# EAGLE design Tritag_Color_Sensor_Board_1.1 (EAGLE 9.5.0)
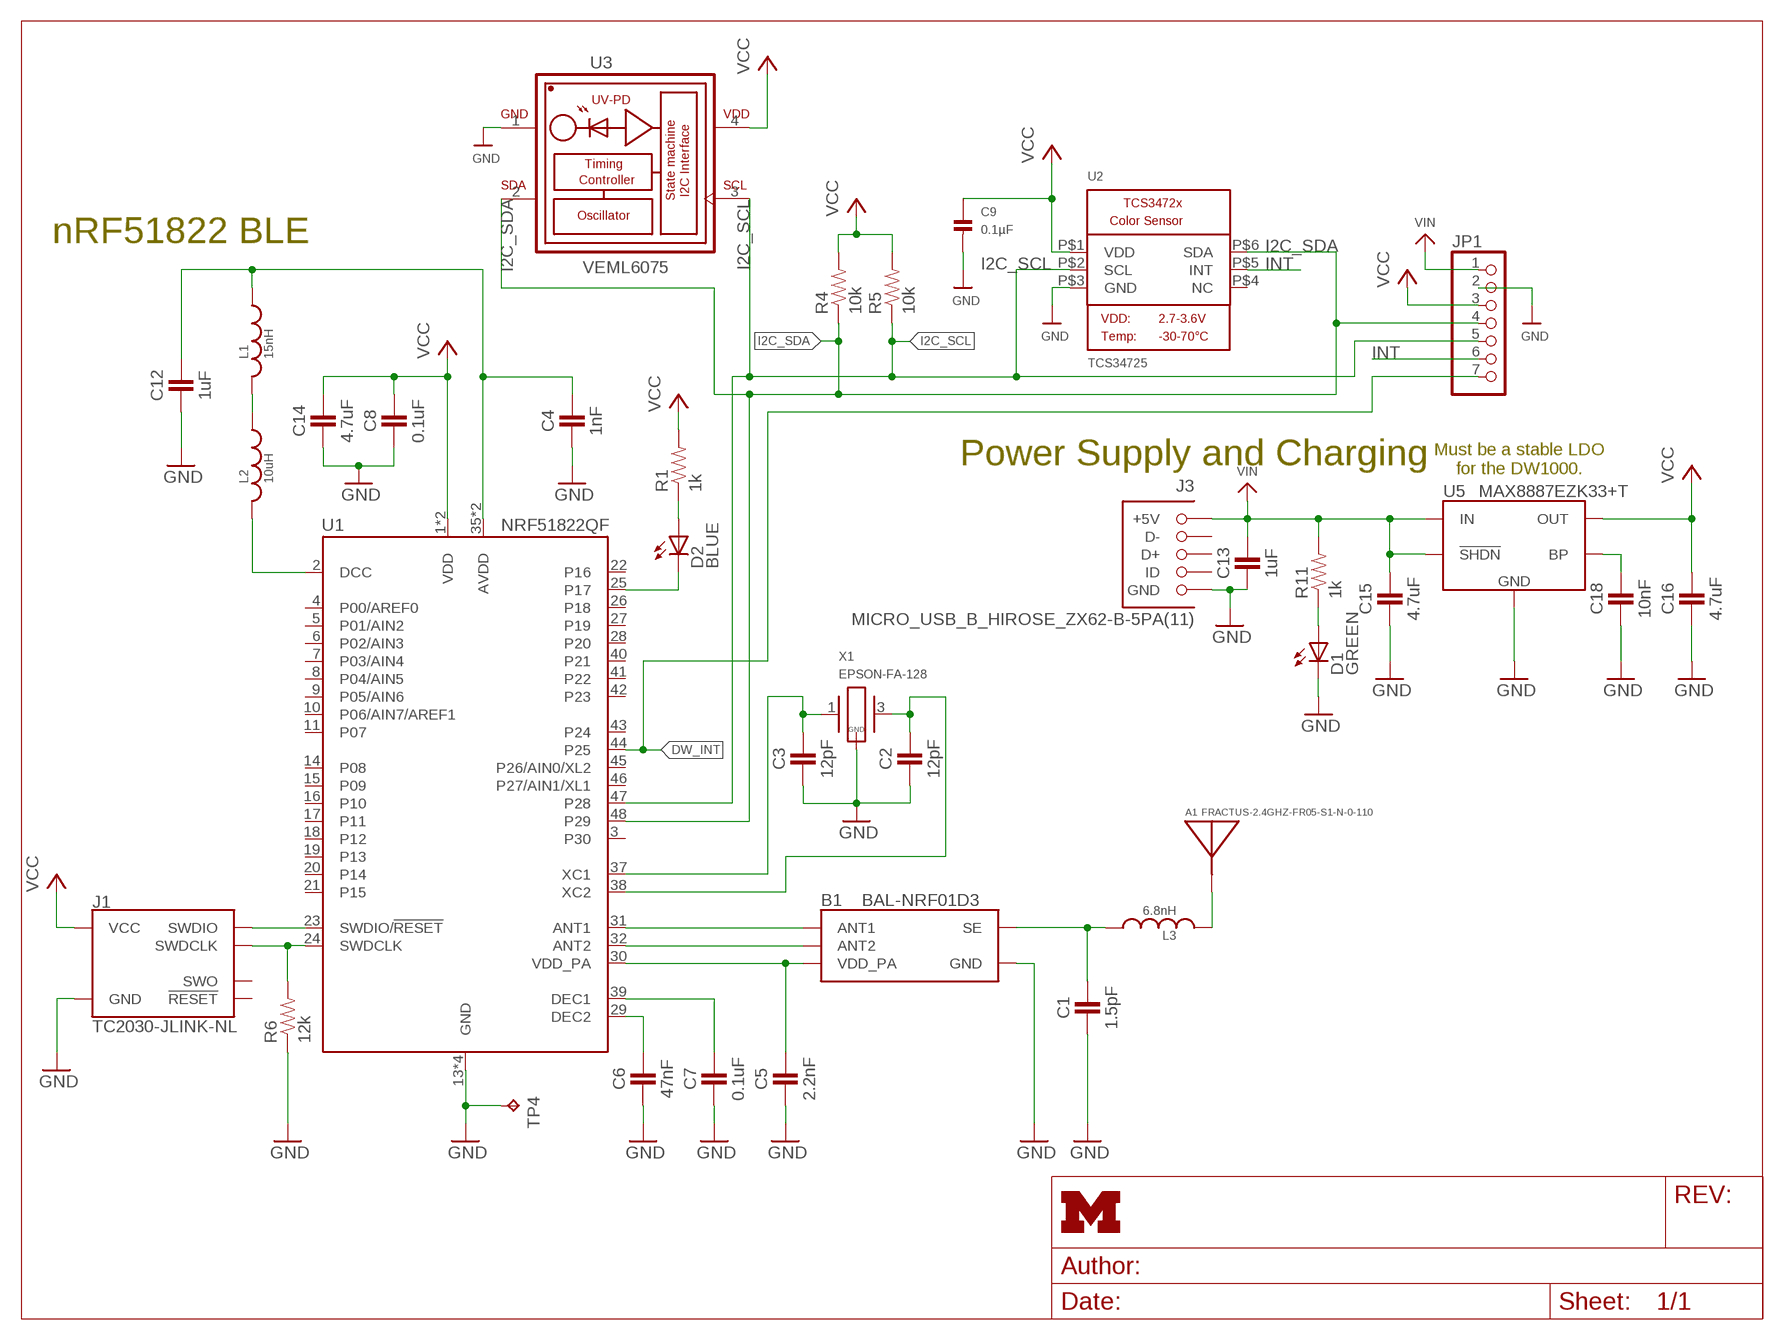
[diagram p0: schematic, sheet 1]
FRAME2 (LETTER_L): HEIGHT: 8.5in; WIDTH: 11in

## Parts
A1  FRACTUS-2.4GHZ-FR05-S1-N-0-110  [FRACTUS-ANTENNA-FR05-S1-N-0-110]
B1  BAL-NRF01D3  [BAL-NRF01D3]
C1  1.5pF  CAPACITOR  [0402_CAP]
C2  12pF  CAPACITOR  [0402_CAP]
C3  12pF  CAPACITOR  [0402_CAP]
C4  1nF  CAPACITOR  [0402_CAP]
C5  2.2nF  CAPACITOR  [0402_CAP]
C6  47nF  CAPACITOR  [0402_CAP]
C7  0.1uF  CAPACITOR  [0402_CAP]
C8  0.1uF  CAPACITOR  [0402_CAP]
C9  0.1µF  CAP_CERAMIC_0805  [_0805]
C12  1uF  CAPACITOR  [0402_CAP]
C13  1uF  CAPACITOR  [0402_CAP]
C14  4.7uF  CAPACITOR  [0402_CAP]
C15  4.7uF  CAPACITOR  [0402_CAP]
C16  4.7uF  CAPACITOR  [0402_CAP]
C18  10nF  CAPACITOR  [0402_CAP]
D1  GREEN  LED0603  [LED-0603]
D2  BLUE  LED0603  [LED-0603]
J1  TC2030-JLINK-NL  [TC2030-IDC-NL]
J3  MICRO_USB_B_HIROSE_ZX62-B-5PA(11)  [USB_MICRO_B-HIROSE-ZX62-B-5PA(11)]
JP1  HEADER-1X770MIL  [1X07_ROUND_70]
L1  15nH  INDUCTOR0402  [0402_CAP]
L2  10uH  INDUCTOR0603  [0603_CAP]
L3  6.8nH  INDUCTOR0402  [0402_CAP]
R1  1k  RESISTOR0402_RES  [0402_RES]
R4  10k  RESISTOR0402_RES  [0402_RES]
R5  10k  RESISTOR0402_RES  [0402_RES]
R6  12k  RESISTOR0402_RES  [0402_RES]
R11  1k  RESISTOR0402_RES  [0402_RES]
TP4  TPTP06SQ  [TP06SQ]
U1  NRF51822QF  [QFN-48-6MM]
U2  TCS34725  LIGHT_TCS3472  [TCS3472_FN6]
U3  VEML6075  [VISHAY_VEML6075_1.25X2X1]
U5  MAX8887EZK33+T  [SOT-23-5]
X1  EPSON-FA-128  [FA-128]

## Nets
!CHRG: D1.A R11.1
!CHRG1: D2.A R1.1
ANTENNA: A1.ANT(ANTENNA) L3.2
AVDD: C4.1 C12.1 L1.1 U1.35(AVDD) U1.36(AVDD)
DCC: L2.2 U1.2(DCC)
DW_INT: JP1.7 U1.44(P25)
GND: B1.GND C1.2 C2.2 C3.2 C4.2 C5.2 C6.2 C7.2 C8.2 C9.2 C12.2 C13.2 C14.2 C15.2 C16.2 C18.2 D1.C J1.5(GND) J3.5(GND) JP1.2 R6.1 TP4.TP U1.13(GND) U1.33(GND) U1.34(GND) U1.GND U2.P$3(GND) U3.1(GND) U5.2(GND) X1.2(GND) X1.4(GND)
I2C_SCL: JP1.5 R5.1 U1.47(P28) U2.P$2(SCL) U3.3(SCL)
I2C_SDA: JP1.4 R4.1 U1.48(P29) U2.P$6(SDA) U3.2(SDA)
INT: JP1.6 U2.P$5(INT)
N$2: B1.SE C1.1 L3.1
N$6: D2.C U1.25(P17)
N$9: C3.1 U1.37(XC1) X1.1
N$10: C2.1 U1.38(XC2) X1.3
N$11: C18.1 U5.4(BP)
N$15: C6.1 U1.29(DEC2)
N$17: C7.1 U1.39(DEC1)
N$18: B1.ANT1 U1.31(ANT1)
N$19: B1.ANT2 U1.32(ANT2)
N$20: B1.VCC(VDD_PA) C5.1 U1.30(VDD_PA)
N$37: L1.2 L2.1
SWDCLK: J1.4(SWDCLK) R6.2 U1.24(SWDCLK)
SWDIO/!RESET: J1.2(SWDIO) U1.23(SWDIO/!RESET)
VCC: C8.1 C9.1 C14.1 C16.1 J1.1(VCC) JP1.3 R1.2 R4.2 R5.2 U1.1(VDD) U1.12(VDD) U2.P$1(VDD) U3.4(VDD) U5.5(OUT)
VIN: C13.1 C15.1 J3.1(+5V) JP1.1 R11.2 U5.1(IN) U5.3(!SHDN)
Unconnected: J1.3(!RESET) J1.6(SWO) J3.2(D-) J3.3(D+) J3.4(ID) U1.3(P30) U1.4(P00/AREF0) U1.5(P01/AIN2) U1.6(P02/AIN3) U1.7(P03/AIN4) U1.8(P04/AIN5) U1.9(P05/AIN6) U1.10(P06/AIN7/AREF1) U1.11(P07) U1.14(P08) U1.15(P09) U1.16(P10) U1.17(P11) U1.18(P12) U1.19(P13) U1.20(P14) U1.21(P15) U1.22(P16) U1.26(P18) U1.27(P19) U1.28(P20) U1.40(P21) U1.41(P22) U1.42(P23) U1.43(P24) U1.45(P26/AIN0/XL2) U1.46(P27/AIN1/XL1) U2.P$4(NC)

## Notes on the sheet
- nRF51822 BLE
- Power Supply and Charging
- Must be a stable LDO
  for the DW1000.

## Library data of the parts
A1 = chips:FRACTUS-2.4GHZ-FR05-S1-N-0-110: Fractus Micro Reach Xtend Requires matching network.; RICHARDSON_RFPD: FR05-S1-N-0110B
B1 = chips:BAL-NRF01D3: 50 ohm nominal input / conjugate match balun to nRF51422-QFAA, nRF24LE1, nRF51822-QFAA/AB, with integrated harmonic filter; DIGIKEY: 497-13637-1-ND; MOUSER: 511-BAL-NRF01D3
C1-C8 C12-C16 C18 = passives:CAPACITOR: 0402 Capacitor
C9 = microbuilder:CAP_CERAMIC: Ceramic Capacitors 0402 - 0402 Surface Mount Capacitors 16pF 50V 5% [Digikey: 445-4899-2-ND] 18pF 50V 5% [Digikey: 490-1281-2-ND] 22pF 50V 5% [Digikey: 490-1283-2-ND] 68pF 50V 5% [Digikey: 490-1289-2-ND] 0.1uF 10V 10% [Digikey: 490-1318-2-ND] 1.0uF 6.3V 10% [Digikey: 490-1320-2-ND] 0603 - 0603 Surface Mount Capacitors 16 pF 50V 5% [Digikey: 445-5051-2-ND] 22 pF 50V [Digikey: PCC220ACVTR-ND] 33 pF 50V 5% [Digikey: 490-1415-1-ND] 56pF 50V 5% [Digikey: 490-1421-1-ND] 220pF 50V 5% [Digikey: 445-1285-1-ND] 680 pF 50V 2200 pF 50V 5% C0G [Digikey: 445-1297-1-ND] 5600 pF 100V 5% X7R [Digikey: 478-3711-1-ND] 0.1 µF 25V 10% [Digikey: PCC2277TR-ND] 0.22 µF 16V 10% X7R [Digikey: 445-1318-1-ND] 1.0 µF 25V 10% [Digikey: 445-5146-2-ND] 0603 - RF Specific 3pF 250V +/-0.1pF RF [Digikey: 712-1347-1-ND] 18 pF 250V 5% [Digikey: 478-3505-1-ND or 712-1322-1-ND] 56 pF 250V 5% C0G RF [Digikey: 490-4867-1-ND] 68 pF 250V RF [Digikey: 490-4868-1-ND] 0805 - 0805 Surface Mount Capacitors 220 pF 250V 2% RF Ceramic Capacitor [Digikey: 712-1398-1-ND] 1000 pF 50V 2% NP0 Ceramic Capacitor [Digikey: 478-3760-1-ND] 0.1 µF 25V 10% Ceramic Capacitor [Digikey: PCC1828TR-ND] 1.0 µF 16V 10% Ceramic Capacitor[Digikey: 490-1691-2-ND] 10.0 µF 10V 10% Ceramic Capacitor[Digikey: 709-1228-1-ND] 10.0 uF 16V 10% Ceramic Capacitor [Digikey: 478-5165-2-ND] 47 uF 6.3V 20% Ceramic Capacitor [Digikey: 587-1779-1-ND or 399-5506-1-ND] 1206 - 1206 Surface Mount Capacitors 47uF 10V 20% Ceramic Capacitor [Digikey: 490-5528-1-ND or 399-5508-1-ND or 445-6010-1-ND] 100uF 6.3V -20%, +80% Y5V Ceramic Capacitor (Digikey: 490-4512-1-ND, Mouser: 81-GRM31CF50J107ZE1L)
D1 D2 = SparkFun-LED:LED: LEDs Standard schematic elements and footprints for 5mm, 3mm, 1206, and 0603 sized LEDs. 5mm - Spark Fun Electronics SKU : COM-00529 (and others)
J1 = connector:TC2030-JLINK
J3 = connector:MICRO_USB_B_HIROSE_ZX62-B-5PA(11): Connector Receptacle USB - micro B 2.0 5 Position Surface Mount, Right Angle, Horizontal Bottom Mount; DIGIKEY: H11634CT-ND; MOUSER: 798-ZX62-B-5PA11; NEWARK: 86P8793
JP1 = microbuilder:HEADER-1X7: PIN HEADER
L1-L3 = passives:INDUCTOR
R1 R4-R6 R11 = passives:RESISTOR: Resistor Basic schematic elements and footprints for 0603, 1206, and PTH resistors.
TP4 = testpad:TP: Test pad
U1 = chips:NRF51822: Multiprotocol Bluetooth® 4.0 low energy/2.4 GHz RF SoC; DIGIKEY: 1490-1032-1-ND; MOUSER: 949-NRF51822-QFAB-R7
U2 = microbuilder:LIGHT_TCS3472: TCS3472 RGB + Clear Color Sensor VDD: 2.7-3.6V Temp: -30 - 70°C IR light blocking filter 3,800,000:1 Dynamic Range 2.5µA sleep state Part IDs TCS34725: I2C bus logic = VDD, I2C address: 0x29 TCS34727: I2C bus logic = 1.8V, I2C address: 0x29
U3 = VEML6075:VEML6075: VEML6075 UVA and UVB Light Sensor with I2C Interface: The VEML6075 senses UVA and UVB light and incorporates photodiode, amplifiers, and analog / digital circuits into a single chip using a CMOS process. When the UV sensor is applied, it is able to detect UVA and UVB intensity to provide a measure of the signal strength as well as allowing for UVI measurement. Device Model created 15.06.2016 by Johannes Kolb - Vishay Semiconductor GmbH; DESCRIPTION: VEML6075 Series 2 x 1.25 x 1 mm 330/365 nm SMT I2C UVA/UVB Light Sensor; DIGI-KEY_PART_NUMBER: VEML6075CT-ND; DIGI-KEY_PURCHASE_URL: https://www.digikey.com/product-detail/en/vishay-semiconductor-opto-division/VEML6075/VEML6075CT-ND/5878946?utm_source=snapeda&utm_medium=aggregator&utm_campaign=symbol; MF: Vishay Semiconductor; MP: VEML6075; PACKAGE: TFLGA-4 Vishay
U5 = chips:MAX8887: IC REG LDO 3.3V 0.3A TSOT23-5; DIGIKEY: MAX8887EZK33+TCT-ND
X1 = crystals:EPSON-FA-128: MHz RANGE CRYSTAL UNIT ULTRA MINIATURE SIZE LOW PROFILE SMD http://www.digikey.com/product-search/en?FV=ffec63d1

## Board
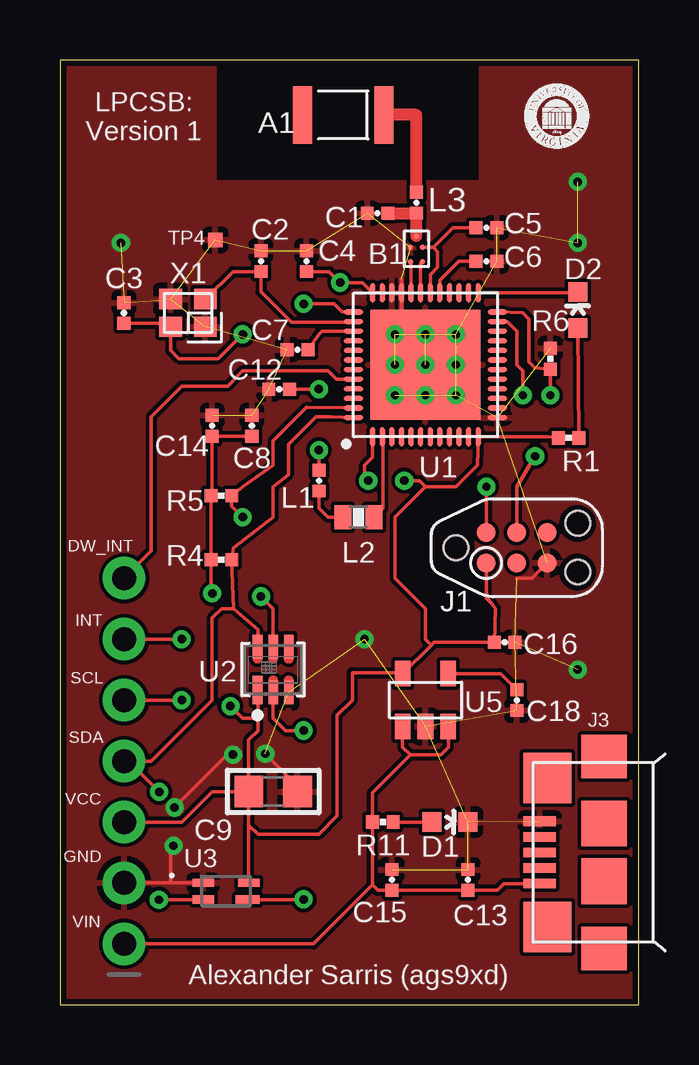
[diagram p1: board, top side]
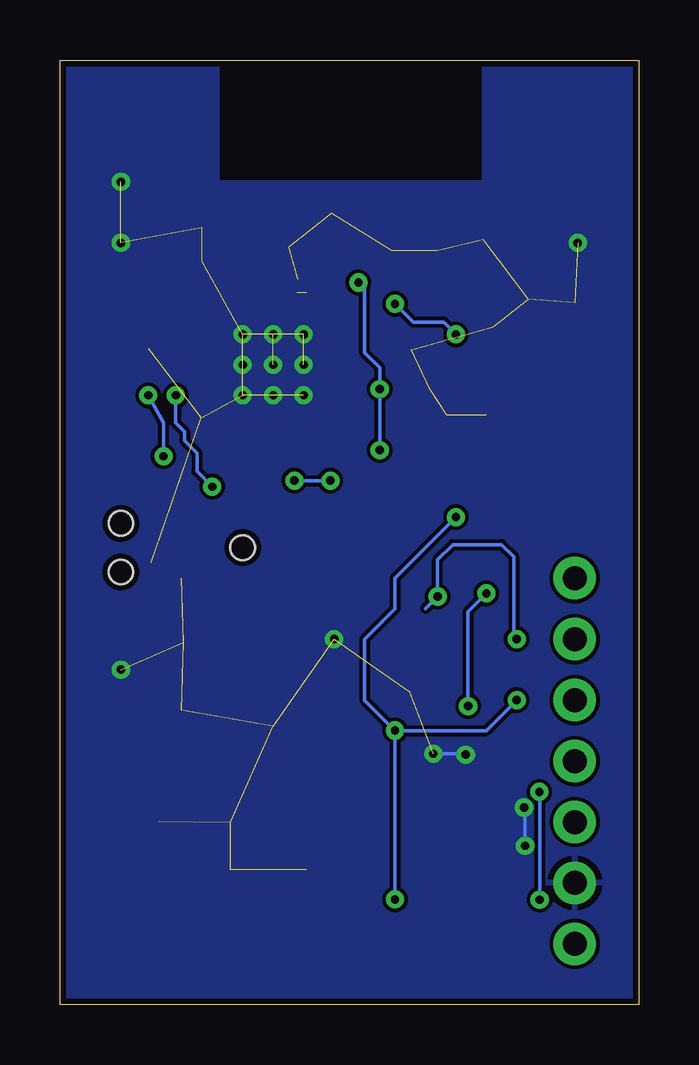
[diagram p2: board, bottom side, seen from below]

Size 24.13 x 39.37 mm. Coordinates in mm from the lower left corner, seen from the top.
Outline: 0,0 24.13,0 24.13,39.37 0,39.36 0,0
Copper layers (1*16): Top 0.035mm / dielectric 1.5mm / Bottom 0.035mm
Design rules "default *": minimum track width 6mil, minimum drill 0.35mm, track to track 6mil, track to pad 6mil, pad to pad 6mil, via to via 6mil, smd to smd 6mil, copper to edge 10mil, drill to drill 6mil, minimum pad ring 10mil, minimum via ring 8mil, stop-mask expansion 4mil, vias tented up to drill 20mil, thermal gap 10mil

### Footprints (pad centres in the part's own frame; a part is rotated, then mirrored left to right if it is on the bottom)
FRACTUS-ANTENNA-FR05-S1-N-0-110 = smd 0.8 x 2.4: ANT -1.7,0; NULL 1.7,0
BAL-NRF01D3 = smd 0.22 x 0.22: ANT1 -0.537,-0.25; ANT2 -0.537,0.25; GND 0.069,0.25; SE 0.537,0; VCC 0.069,-0.25
0402_CAP = smd 0.536 x 0.546: 1 -0.433,0; 2 0.433,0
_0805 = smd 1.2 x 1.3: 1 -1.016,0; 2 1.016,0
LED-0603 = smd 0.8 x 0.8: A 0,-0.75; C 0,0.75
TC2030-IDC-NL = smd 0.787 x 0.787: 1 -1.27,-0.635; 2 -1.27,0.635; 3 0,-0.635; 4 0,0.635; 5 1.27,-0.635; 6 1.27,0.635 | hole 1.016: -2.54,0; 2.54,1.016; 2.54,-1.016
USB_MICRO_B-HIROSE-ZX62-B-5PA(11) = smd 0.4 x 1.35: 1 -1.3,4.125; 2 -0.65,4.125; 3 0,4.125; 4 0.65,4.125; 5 1.3,4.125 | smd 2.1 x 2: P$1 3.1,3.8; P$2 -3.1,3.8 | smd 1.8 x 1.9: P$3 -4,1.45; P$6 4,1.45 | smd 1.9 x 1.9: P$4 -1.2,1.45; P$5 1.2,1.45
1X07_ROUND_70 = drill 1 pad 1.778: 1 -7.62,0; 2 -5.08,0; 3 -2.54,0; 4 0,0; 5 2.54,0; 6 5.08,0; 7 7.62,0
0603_CAP = smd 0.7 x 1: 1 -0.65,0; 2 0.65,0
0402_RES = smd 0.536 x 0.546: 1 -0.433,0; 2 0.433,0
TP06SQ = smd 0.6 x 0.6: TP 0,0
QFN-48-6MM = smd 0.8 x 0.203: 1 -3,2.2; 2 -3,1.8; 3 -3,1.4; 4 -3,1; 5 -3,0.6; 6 -3,0.2; 7 -3,-0.2; 8 -3,-0.6; 9 -3,-1; 10 -3,-1.4; 11 -3,-1.8; 12 -3,-2.2; 25 3,-2.2; 26 3,-1.8; 27 3,-1.4; 28 3,-1; 29 3,-0.6; 30 3,-0.2; 31 3,0.2; 32 3,0.6; 33 3,1; 34 3,1.4; 35 3,1.8; 36 3,2.2 | smd 0.203 x 0.8: 13 -2.2,-3; 14 -1.8,-3; 15 -1.4,-3; 16 -1,-3; 17 -0.6,-3; 18 -0.2,-3; 19 0.2,-3; 20 0.6,-3; 21 1,-3; 22 1.4,-3; 23 1.8,-3; 24 2.2,-3; 37 2.2,3; 38 1.8,3; 39 1.4,3; 40 1,3; 41 0.6,3; 42 0.2,3; 43 -0.2,3; 44 -0.6,3; 45 -1,3; 46 -1.4,3; 47 -1.8,3; 48 -2.2,3 | smd 4.6 x 4.6: GND 0,0
TCS3472_FN6 = smd 1.2 x 0.4: P$1 -0.85,0.65 | smd 1 x 0.4: P$2 -0.95,0; P$3 -0.95,-0.65; P$4 0.95,-0.65; P$5 0.95,0; P$6 0.95,0.65
VISHAY_VEML6075_1.25X2X1 = smd 0.9 x 0.35: 1 -0.95,0.35; 2 -0.95,-0.35; 4 0.95,0.35 | smd 1 x 0.35: 3 0.9,-0.35
SOT-23-5 = smd 0.65 x 1.06: 1 -0.95,-1.1; 2 0,-1.1; 3 0.95,-1.1; 4 0.95,1.1; 5 -0.95,1.1
FA-128 = smd 0.95 x 0.85: 1 -0.725,-0.575; 2 0.725,-0.575; 3 0.725,0.575; 4 -0.725,0.575

### Placement (x,y rotation side)
A1  11.81,37.08 180 top
B1  14.86,31.5 90 top
C1  13.25,32.98 180 top
C2  8.38,30.99 90 top
C3  2.67,28.83 90 top
C4  10.29,30.99 90 top
C5  17.78,32.38 0 top
C6  17.78,30.99 0 top
C7  9.91,27.3 180 top
C8  8,24.13 90 top
C9  8.89,8.89 0 top
C12  9.14,25.65 180 top
C13  17.02,5.21 90 top
C14  6.35,24.13 90 top
C15  13.84,5.21 90 top
C16  18.54,15.11 0 top
C18  19.05,12.7 270 top
D1  16.26,7.62 270 top
D2  21.59,28.96 0 top
J1  19.05,19.05 0 top
J3  24.13,6.35 90 top
JP1  2.67,10.16 90 top
L1  10.79,21.84 270 top
L2  12.45,20.32 0 top
L3  14.86,33.43 90 top
R1  21.21,23.62 180 top
R4  6.73,18.54 180 top
R5  6.73,21.21 180 top
R6  20.45,26.92 270 top
R11  13.46,7.62 180 top
TP4  6.48,31.88 0 top
U1  15.24,26.67 90 top
U2  8.89,13.97 90 top
U3  6.92,4.74 0 top
U5  15.24,12.7 0 top
X1  5.33,28.83 0 top

### Tracks (layer width: path | path; a pad name or v marks a point on that pad's centre or on a via)
!CHRG
  Top 0.152: R11.1 D1.A
!CHRG1
  Top 0.152: 21.26,28.15 D2.A R1.1
ANTENNA
  Top 0.508: L3.2 14.86,37.08 A1.ANT
AVDD  (via drill 0.35)
  Top 0.152: U1.35 U1.36 12.61,30.1 v11.68,30.1 11.23,30.55 C4.1 | L1.1 v10.79,23.11 | C12.1 v10.79,25.65
  Bottom 0.152: v10.79,23.11 v10.79,25.65 10.79,26.54 11.43,27.18 11.43,29.84 v11.68,30.1
DCC
  Top 0.152: L2.2 13.46,20.69 13.46,23.65 U1.2
DW_INT
  Top 0.152: U1.44 11.52,26.07 11.18,26.42 7.62,26.42 6.99,25.78 5.08,25.78 3.81,24.51 3.81,18.92 JP1.7
GND  (via drill 0.35)  (40 unrouted)
  Top 0.152: U1.GND 14.24,27.67 U1.33 14.24,30.21 14.22,30.23 | J1.5 19.68,17.78 19.05,17.78 | JP1.2 4.61,5.08 | 4.61,5.08 U3.1 | 4.61,5.08 4.61,6.5 v4.73,6.63 | v4.78,8.23 6.97,10.43 v7.21,10.43 | v8.56,10.46 9.91,9.12 C9.2
  Bottom 0.152: v4.73,6.63 4.73,8.19 v4.78,8.23 | v7.21,10.43 7.25,10.46 v8.56,10.46
  other vias: 2.54,31.75 21.59,34.29 12.7,15.24 21.59,13.97 21.59,31.75 13.97,27.94 15.24,27.94 15.24,27.94 13.97,27.94 16.51,27.94 13.97,26.67 13.97,26.67 15.24,26.67 16.51,26.67 13.97,25.4 15.24,25.4 15.24,25.4 16.51,25.4
  pour Bottom: -1.27,40.64 -1.27,-1.27 26.67,-1.27 26.67,40.64 17.53,40.64 17.53,34.29 6.48,34.29 6.48,40.64
  pour Top: -1.27,40.64 -1.27,-1.27 26.67,-1.27 26.67,40.64 17.53,40.64 17.53,34.29 6.48,34.29 6.48,40.64
I2C_SCL  (via drill 0.35)
  Top 0.152: U1.47 10.29,24.89 8.89,23.5 8.89,22.48 7.62,21.59 R5.1 7.16,20.78 v7.62,20.32 | v10.16,11.43 9.4,11.43 8.89,11.94 U2.P$2 | v5.08,12.7 JP1.5 | v10.16,4.39 v10.15,4.39 U3.3
  Bottom 0.152: v10.16,11.43 11.43,12.7 11.43,15.24 10.16,16.51 10.16,17.78 v7.62,20.32 | v10.16,11.43 6.35,11.43 v5.08,12.7 | v10.16,11.43 v10.16,4.39
I2C_SDA  (via drill 0.35)
  Top 0.152: U2.P$6 8.26,15.62 7.24,16.51 | 7.24,16.51 R4.1 7.24,19.05 8.89,20.32 8.89,21.59 9.53,22.1 9.53,23.37 10.67,24.51 11.3,24.51 U1.48 | 7.24,16.51 6.73,16.51 6.35,16.13 6.35,12.7 3.81,10.16 JP1.4 2.86,10.16 v4.14,8.88 | U3.2 v4.13,4.39 v4.13,4.38
  Bottom 0.152: v4.13,4.38 4.13,8.87 v4.14,8.88
INT  (via drill 0.35)
  Top 0.152: U2.P$5 8.89,16.51 v8.38,17.02 | v5.08,15.24 JP1.6
  Bottom 0.152: 8.89,16.51 v8.38,17.02 8.38,18.54 7.75,19.18 5.71,19.18 5.21,18.67 5.21,15.37 v5.08,15.24
N$2
  Top 0.152: 14.85,32.98 L3.1
  Top 0.508: B1.SE L3.1 | C1.1 14.85,32.98
N$6
  Top 0.152: U1.25 21.17,29.67 D2.C
N$9  (via drill 0.35)
  Top 0.152: C3.1 4.47,28.4 X1.1 | U1.37 11.77,28.87 11.43,29.21 v10.16,29.21 | 4.57,28.22 X1.1 | X1.1 4.61,27.27 4.95,26.92 6.6,26.92 v7.62,27.94
  Bottom 0.152: v7.62,27.94 8.13,28.45 9.4,28.45 v10.16,29.21
N$10
  Top 0.152: X1.3 7.21,30.55 C2.1 8.38,29.72 9.65,28.45 12.22,28.45 U1.38
N$11
  Top 0.152: U5.4 18.38,13.8 C18.1
N$15
  Top 0.152: 15.88,29.7 U1.29 15.84,30.19 16.64,30.99 C6.1
N$17
  Top 0.152: C7.1 10.79,27.94 10.92,28.07 U1.39
N$18
  Top 0.152: U1.31 15.04,30.89 B1.ANT1
N$19
  Top 0.152: U1.32 14.64,30.93 B1.ANT2
N$20
  Top 0.152: U1.30 15.44,30.43 15.75,30.73 15.75,31.38 15.56,31.57 | C5.1 16.38,32.38 15.56,31.57 | 15.56,31.57 B1.VCC
N$37
  Top 0.152: L2.1 11.18,20.32 10.79,20.7 L1.2
SWDCLK  (via drill 0.35)
  Top 0.152: v20.45,25.4 R6.2 19.81,26.54 19.56,26.8 19.56,28.57 19.3,28.83 U1.24 | J1.4 19.05,21.59 v19.81,22.86
  Bottom 0.152: v19.81,22.86 19.81,24.26 v20.45,25.4
SWDIO/!RESET  (via drill 0.35)
  Top 0.152: U1.23 18.65,28.47 19.05,28.07 19.05,26.67 19.3,26.42 v19.3,25.4 | v17.78,21.59 J1.2
  Bottom 0.152: v19.3,25.4 19.3,24.26 18.92,23.88 18.92,23.5 18.41,22.99 18.41,22.23 v17.78,21.59
VCC  (via drill 0.35)
  Top 0.152: C9.1 6.35,8.89 5.08,7.62 JP1.3 | 15.48,14.99 U5.5 14.25,13.84 12.19,13.84 12.19,12.7 11.56,12.06 11.56,7.87 10.79,7.11 8.26,7.11 7.87,7.49 | 15.48,14.99 15.6,15.11 C16.1 18.16,16.51 18.02,16.69 | C8.1 C14.1 6.35,21.26 R5.2 R4.2 6.3,17.2 v6.35,17.14 | R1.2 20.35,23.67 U1.12 17.4,22.48 16.51,21.59 15.24,21.59 | C9.1 7.87,11.05 8.26,11.43 8.26,12.06 | 8.26,12.06 8.26,13.11 U2.P$1 | 18.02,16.69 17.78,17.02 | 15.24,21.59 13.97,20.32 13.97,17.78 15.24,16.51 15.24,15.24 15.48,14.99 | v7.11,12.45 7.62,11.94 8.13,11.94 8.26,12.06 | C9.1 7.87,7.49 | 15.24,21.59 14.99,21.84 v14.35,21.84 | v12.86,21.84 12.7,22 12.7,22.48 13.04,22.82 U1.1 | 18.02,16.69 17.78,16.94 J1.1 | U3.4 7.87,7.49
  Bottom 0.152: v6.35,17.14 7.11,16.38 v7.11,12.45 | v14.35,21.84 v12.86,21.84
VIN
  Top 0.152: J3.1 18.51,5.05 18.24,4.77 C13.1 C15.1 13.26,4.77 13.03,5 | U5.1 14.29,10.73 14.61,10.41 | 14.61,10.41 15.88,10.41 16.19,10.73 U5.3 | 14.61,10.41 13.03,8.84 R11.2 13.03,5 | 13.03,5 10.56,2.54 JP1.1

### Text on the board
tPlace: LPCSB: / Version 1 | DW_INT | INT | SCL | SDA | VCC | GND | VIN | Alexander Sarris (ags9xd)